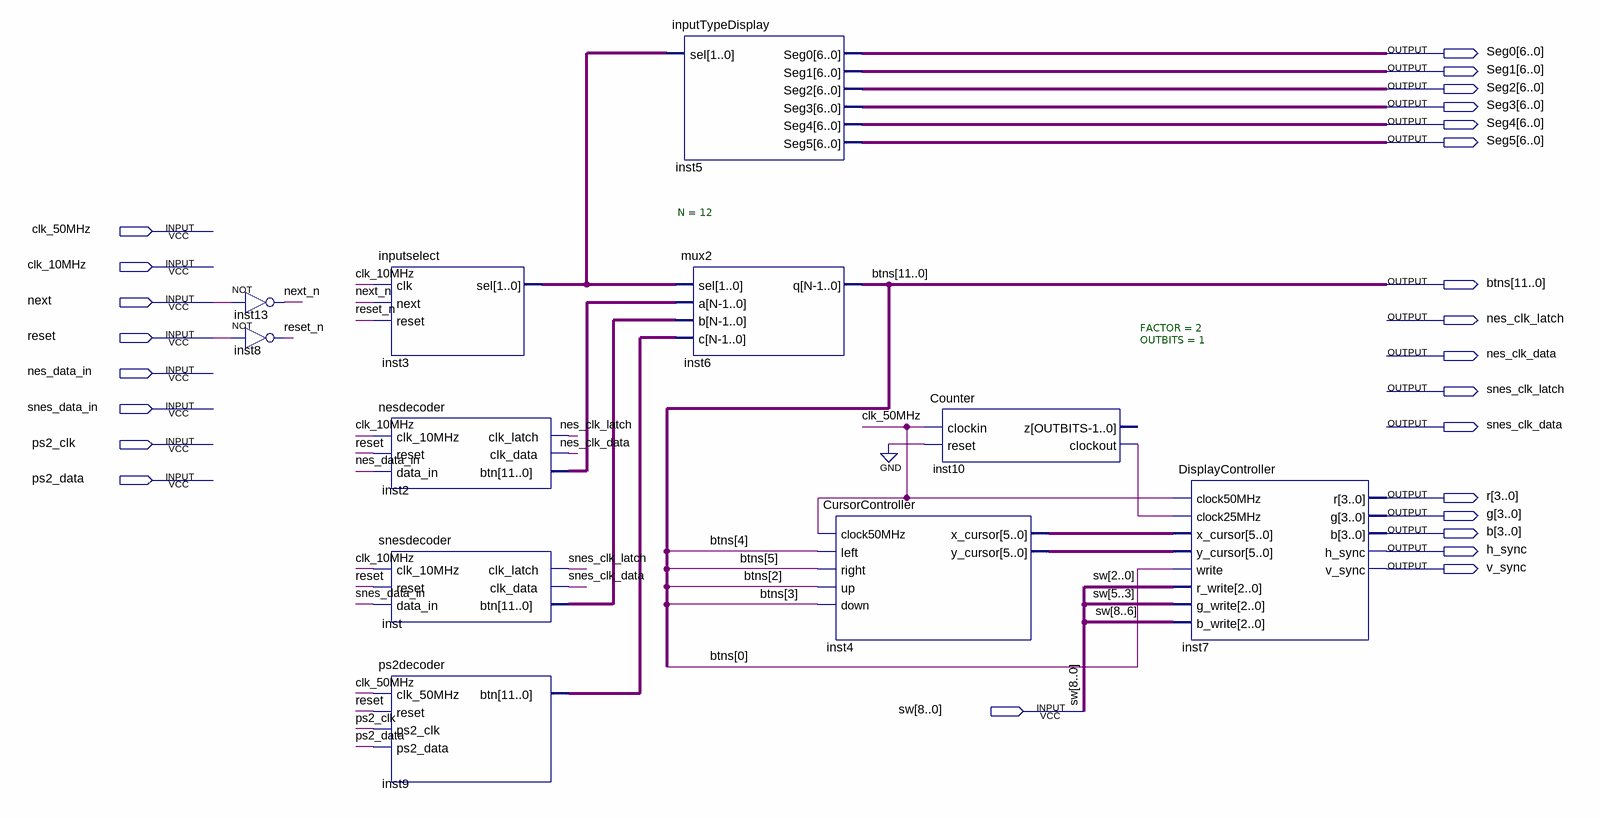
[diagram p0: schematic sheet]
// Quartus schematic designproject.bdf as structural Verilog: 11 symbols, 25 pins
module designproject (
  input  clk_50MHz,
  input  clk_10MHz,
  input  next,
  input  reset,
  input  nes_data_in,
  input  snes_data_in,
  input  ps2_clk,
  input  ps2_data,
  input  [8:0] sw,
  output [6:0] Seg0,
  output [6:0] Seg1,
  output [6:0] Seg2,
  output [6:0] Seg3,
  output [6:0] Seg4,
  output [6:0] Seg5,
  output [11:0] btns,
  output nes_clk_latch,
  output nes_clk_data,
  output snes_clk_latch,
  output snes_clk_data,
  output [3:0] r,
  output [3:0] g,
  output [3:0] b,
  output h_sync,
  output v_sync
);

  wire inst10_clockout, next_n, reset_n;
  wire [1:0] inst3_sel;
  wire [5:0] inst4_x_cursor, inst4_y_cursor;
  wire [11:0] inst2_btn, inst9_btn, inst_btn;

  not inst13 (next_n, next);
  not inst8 (reset_n, reset);
  inputselect inst3 (.clk(clk_10MHz), .next(next_n), .reset(reset_n), .sel(inst3_sel));
  nesdecoder inst2 (
    .clk_10MHz(clk_10MHz), .reset(reset), .data_in(nes_data_in), .clk_latch(nes_clk_latch),
    .clk_data(nes_clk_data), .btn(inst2_btn));
  snesdecoder inst (
    .clk_10MHz(clk_10MHz), .reset(reset), .data_in(snes_data_in), .clk_latch(snes_clk_latch),
    .clk_data(snes_clk_data), .btn(inst_btn));
  ps2decoder inst9 (.clk_50MHz(clk_50MHz), .reset(reset), .ps2_clk(ps2_clk), .ps2_data(ps2_data), .btn(inst9_btn));
  inputTypeDisplay inst5 (
    .sel(inst3_sel), .Seg0(Seg0), .Seg1(Seg1), .Seg2(Seg2), .Seg3(Seg3), .Seg4(Seg4), .Seg5(Seg5));
  mux2 #(.N(12)) inst6 (.sel(inst3_sel), .a(inst2_btn), .b(inst_btn), .c(inst9_btn), .q(btns));
  CursorController inst4 (
    .clock50MHz(clk_50MHz), .left(btns[4]), .right(btns[5]), .up(btns[2]), .down(btns[3]),
    .x_cursor(inst4_x_cursor), .y_cursor(inst4_y_cursor));
  Counter #(.FACTOR(2), .OUTBITS(1)) inst10 (.clockin(clk_50MHz), .reset(1'b0), .clockout(inst10_clockout));  // open: z
  DisplayController inst7 (
    .clock50MHz(clk_50MHz), .clock25MHz(inst10_clockout), .x_cursor(inst4_x_cursor),
    .y_cursor(inst4_y_cursor), .write(btns[0]), .r_write(sw[2:0]), .g_write(sw[5:3]), .b_write(sw[8:6]),
    .r(r), .g(g), .b(b), .h_sync(h_sync), .v_sync(v_sync));
endmodule
